# Altium schematic sheet Sheet1.SchDoc
size A
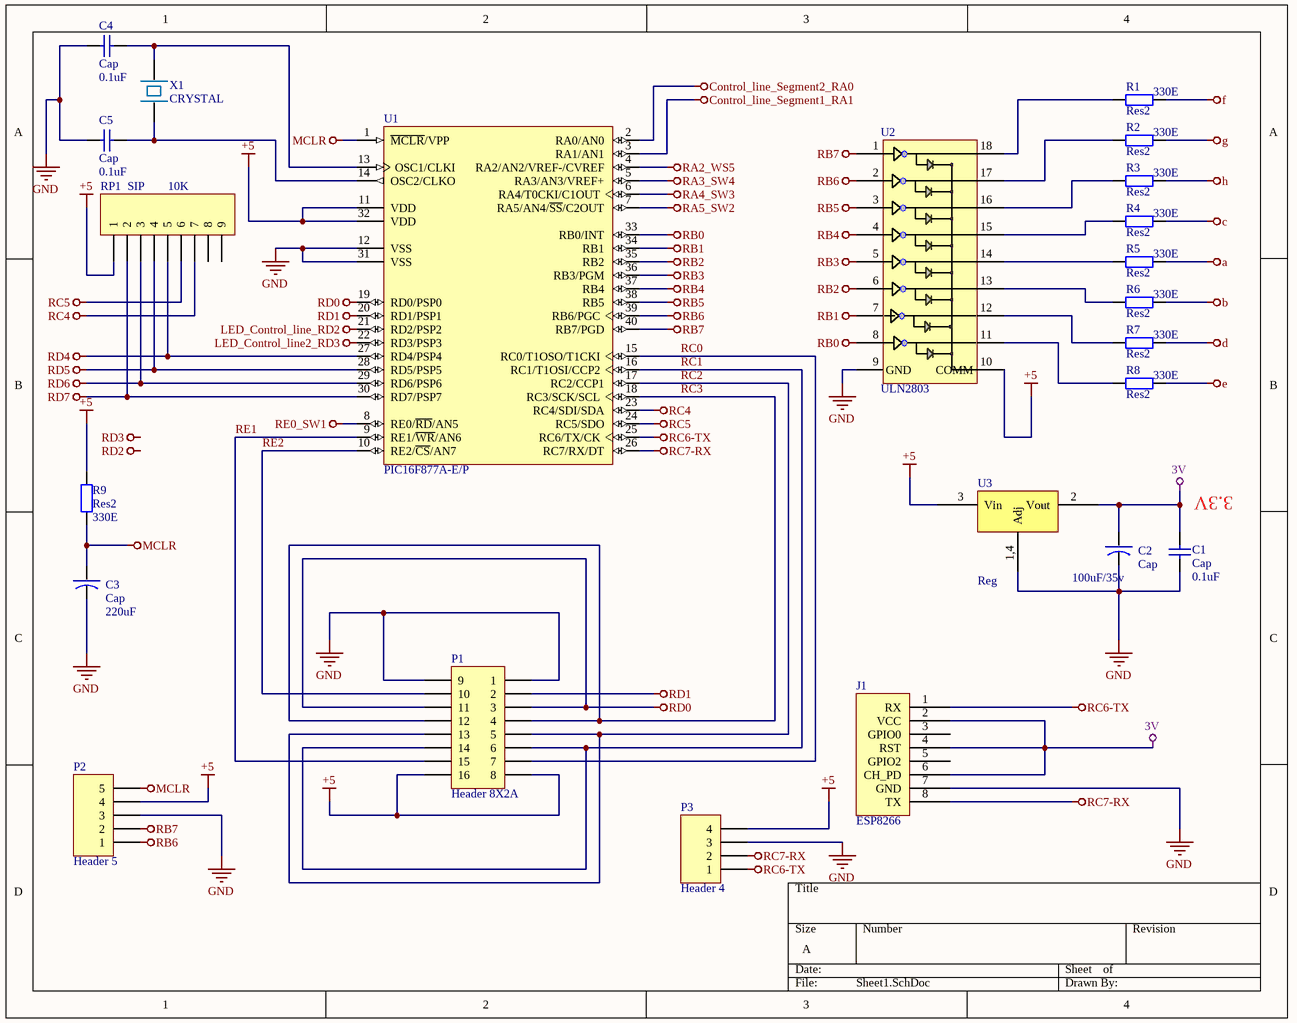
[diagram p0: Sheet1.SchDoc]

## Parts
C1  Cap  [RES0805]
C2  Cap  value 100uF/35v  [Capacitor10UF/63V]
C3  Cap  [CAP_220uF]
C4  Cap  [CAP_104]
C5  Cap  [CAP_104]
J1  ESP8266  [ESP8266]
P1  Header 8X2A  [HDR2X8_CEN]
P2  Header 5  [HDR1X5]
P3  Header 4  [HDR1X4]
R1  Res2  value 330E  [AXIAL-0.4]
R2  Res2  value 330E  [AXIAL-0.4]
R3  Res2  value 330E  [AXIAL-0.4]
R4  Res2  value 330E  [AXIAL-0.4]
R5  Res2  value 330E  [AXIAL-0.4]
R6  Res2  value 330E  [AXIAL-0.4]
R7  Res2  value 330E  [AXIAL-0.4]
R8  Res2  value 330E  [AXIAL-0.4]
R9  Res2  value 330E  [AXIAL-0.4]
RP1  SIP  value 10K  [HDR1X9]
U1  PIC16F877A-E/P  [PDIP600-P40]
U2  ULN2803  [ULN2803]
U3  Reg  [LM1117]
X1  CRYSTAL  [CRYSTAL]

## Nets
3V: C1.2(A) C2.1(a) J1.2(VCC) J1.4(RST) J1.6(CH_PD) U3.2(Vout)
+5: P1.8 P1.16 P2.4 P3.4 R9.2 RP1.1 U1.11(VDD) U1.32(VDD) U2.10(COMM) U3.3(Vin)
a: R5.2
b: R6.2
c: R4.2
Control_line_Segment1_RA1: U1.3(RA1/AN1)
Control_line_Segment2_RA0: U1.2(RA0/AN0)
d: R7.2
e: R8.2
f: R1.2
g: R2.2
GND: C1.1(A) C2.2(b) C3.2(b) C4.1(A) C5.1(A) J1.7(GND) P1.1 P1.9 P2.3 P3.3 U1.12(VSS) U1.31(VSS) U2.9(GND) U3.1,4(Adj)
h: R3.2
LED_Control_line2_RD3: U1.22(RD3/PSP3)
LED_Control_line_RD2: U1.21(RD2/PSP2)
MCLR: C3.1(a) P2.5 R9.1 U1.1(~{MCLR}/VPP)
RA2_WS5: U1.4(RA2/AN2/VREF-/CVREF)
RA3_SW4: U1.5(RA3/AN3/VREF+)
RA4_SW3: U1.6(RA4/T0CKI/C1OUT)
RA5_SW2: U1.7(RA5/AN4/~{SS}/C2OUT)
RB0: U1.33(RB0/INT) U2.8
RB1: U1.34(RB1) U2.7
RB2: U1.35(RB2) U2.6
RB3: U1.36(RB3/PGM) U2.5
RB4: U1.37(RB4) U2.4
RB5: U1.38(RB5) U2.3
RB6: P2.1 U1.39(RB6/PGC) U2.2
RB7: P2.2 U1.40(RB7/PGD) U2.1
RC4: RP1.7 U1.23(RC4/SDI/SDA)
RC5: RP1.6 U1.24(RC5/SDO)
RC6-TX: J1.1(RX) P3.1 U1.25(RC6/TX/CK)
RC7-RX: J1.8(TX) P3.2 U1.26(RC7/RX/DT)
RD0: P1.3 P1.11 U1.19(RD0/PSP0)
RD1: P1.2 U1.20(RD1/PSP1)
RD4: RP1.5 U1.27(RD4/PSP4)
RD5: RP1.4 U1.28(RD5/PSP5)
RD6: RP1.3 U1.29(RD6/PSP6)
RD7: RP1.2 U1.30(RD7/PSP7)
RE0_SW1: U1.8(RE0/~{RD}/AN5)
RC0: P1.7 U1.15(RC0/T1OSO/T1CKI)
RC1: P1.6 P1.14 U1.16(RC1/T1OSI/CCP2)
RC2: P1.5 P1.13 U1.17(RC2/CCP1)
RC3: P1.4 P1.12 U1.18(RC3/SCK/SCL)
RE1: P1.15 U1.9(RE1/~{WR}/AN6)
RE2: P1.10 U1.10(RE2/~{CS}/AN7)
NetC4_2: C4.2(A) U1.13(OSC1/CLKI) X1.2(b)
NetC5_2: C5.2(A) U1.14(OSC2/CLKO) X1.1(a)
NetR1_1: R1.1 U2.18
NetR2_1: R2.1 U2.17
NetR3_1: R3.1 U2.16
NetR4_1: R4.1 U2.15
NetR5_1: R5.1 U2.14
NetR6_1: R6.1 U2.13
NetR7_1: R7.1 U2.12
NetR8_1: R8.1 U2.11

Not connected (* = marked no-connect by the designer): J1 3(GPIO0) 5(GPIO2); RP1 8 9

## Notes on the sheet
- (near C1) 3.3V
- Labels drawn without touching a wire or pin: RD2, RD3
- (in symbol CAP_104) 0.1uF
- (in symbol CAP_104_SMD) 0.1uF
- (in symbol CAP_220uF) 220uF

## Library data of the parts
C1 = CAP_104_SMD
C2 = Cap-10uf/63V: Cap10uf/63V
C3 = CAP_220uF
C4 C5 = CAP_104
J1 = ESP8266: WIFI Module
P1 = Header 8X2A: Header, 8-Pin, Dual row; LatestRevisionDate: 17-Jul-2002; LatestRevisionNote: Re-released for DXP Platform.; Publisher: Altium Limited
P2 = Header 5: Header, 5-Pin; LatestRevisionDate: 17-Jul-2002; LatestRevisionNote: Re-released for DXP Platform.; Publisher: Altium Limited
P3 = Header 4: Header, 4-Pin; LatestRevisionDate: 17-Jul-2002; LatestRevisionNote: Re-released for DXP Platform.; Publisher: Altium Limited
R1-R9 = Res2: Resistor; Published: 8-Jun-2000; LatestRevisionDate: 17-Jul-2002; LatestRevisionNote: Re-released for DXP Platform.; PackageReference: AXIAL-0.4; Publisher: Altium Limited; PackageDescription: Axial Device, Thru-Hole; 2 Leads; 0.4 in Pin Spacing
RP1 = Header 9: Network resistor 9 pin; LatestRevisionDate: 17-Jul-2002; LatestRevisionNote: Re-released for DXP Platform.; Publisher: Altium Limited
U1 = PIC16F877A-E/P: Enhanced FLASH Microcontroller, 8K (x14-Bit words) FLASH, 368 Bytes RAM, 40-Pin PDIP, Standard VDD Range, Extended Temperature; ComponentAvailability: Unknown. Contact manufacturer to determine status.; Published: 11-Oct-2004; LatestRevisionDate: 29-Jan-2009; LatestRevisionNote: Sch. layout revised. 3D Model Removed.; DatasheetVersion: revB, Oct-2003; PackageVersion: revBB, Aug-2009; PackageReference: PDIP600-P40; Publisher: Altium Limited; PackageDescription: 40-Lead Plastic Dual In-Line (P) - 600 mil Body [PDIP]; Supplier 1: Digi-Key; Supplier Part Number 1: PIC16F877A-E/P-ND; Supplier 2: Farnell; Supplier Part Number 2: 1567990; ComponentLink1Description: Datasheet; ComponentLink1URL: http://ww1.microchip.com/downloads/en/DeviceDoc/39582b.pdf; ComponentLink2Description: Packaging Specification; ComponentLink2URL: http://www.microchip.com/stellent/groups/techpub_sg/documents/packagingspec/en012702.pdf; ComponentLink3Description: Microchip.com Home; ComponentLink3URL: http://www.microchip.com/
U2 = ULN2803: 􀃯voltage,  high􀃯current darlington drivers comprised of eight NPN  darlington pairs.  All units feature integral clamp diodes for
U3 = LM1117